# Altium project Keyboard_Mouse.PrjPcb
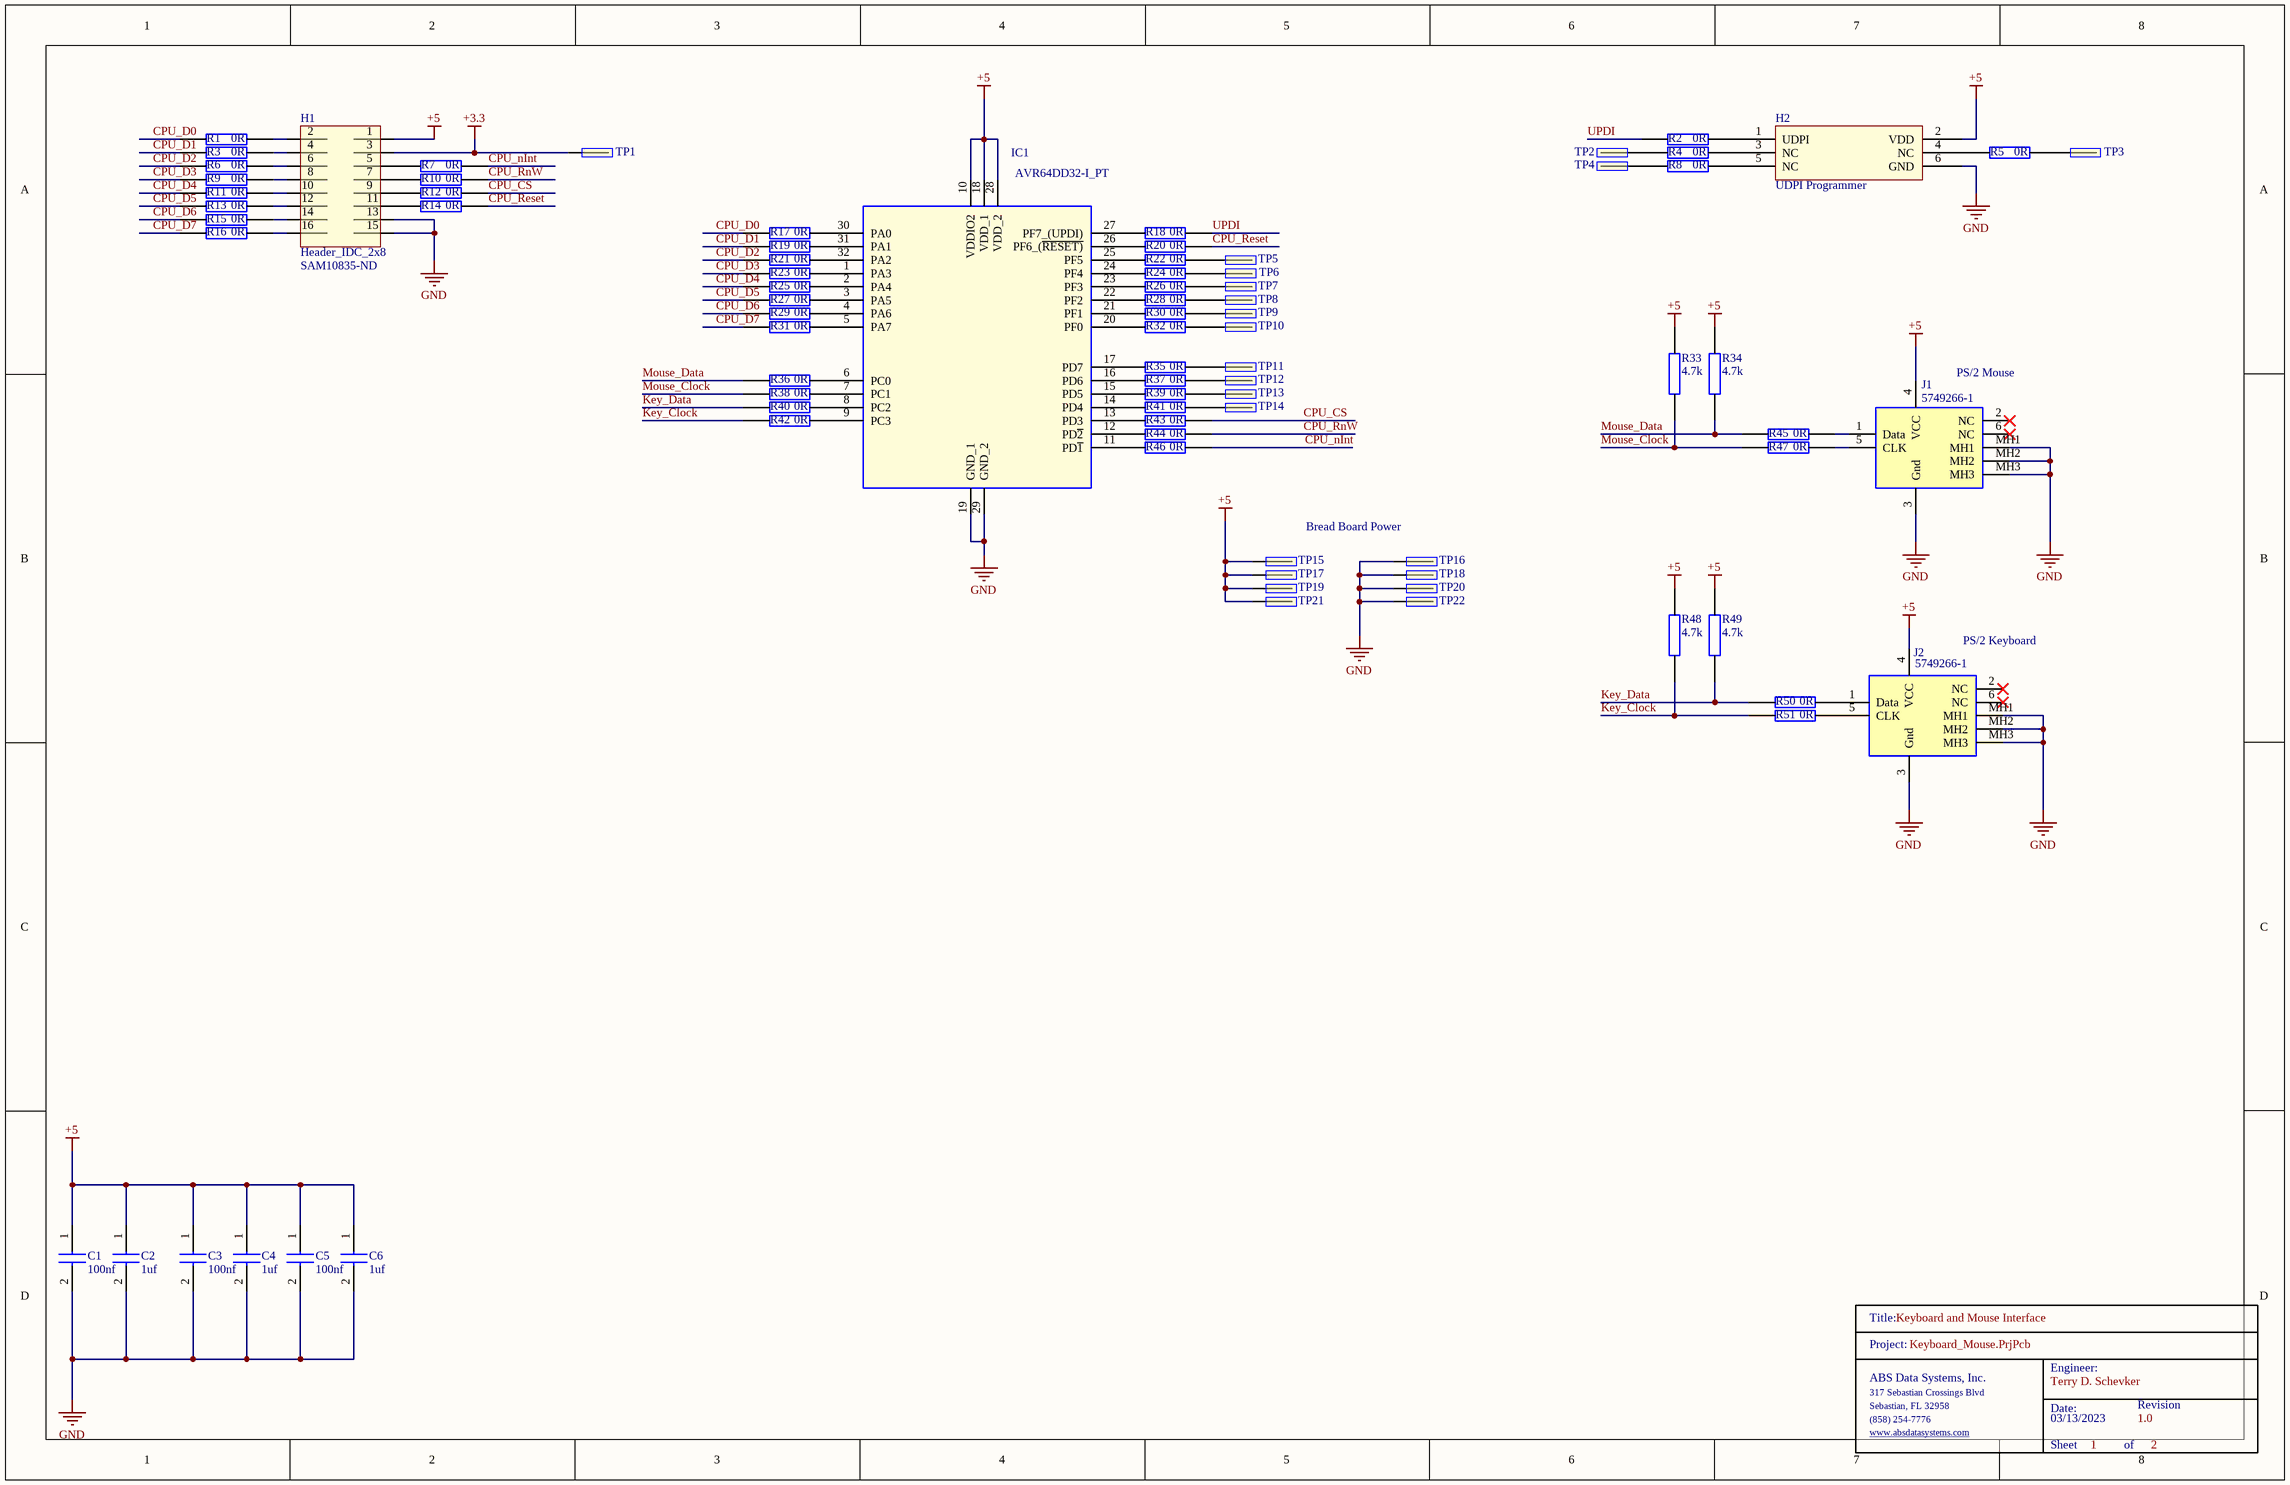
[diagram p0: Keyboard_Mouse_Card.SchDoc]
2 sheets, 134 parts. Net scope: global (net labels, ports and power ports of the same name join across sheets).
Board file: Keyboard_Mouse_PCB.PcbDoc
Sheets:
  Keyboard_Mouse_Card.SchDoc
  Keyboard_Mouse_LED_Monitor.SchDoc

## Sheet Keyboard_Mouse_Card.SchDoc: Keyboard and Mouse Interface
size Tabloid; Date: 03/13/2023; Engineer: Terry D. Schevker; Revision: 1.0; SheetNumber: 1; SheetTotal: 2

### Parts
C1  100nf  [0603]
C2  1uf  [0603]
C3  100nf  [0603]
C4  1uf  [0603]
C5  100nf  [0603]
C6  1uf  [0603]
H1  Header_IDC_2x8  Supplier Part Number 1: SAM10835-ND  [HEADER16]
H2  UDPI Programmer  [HDR2X3]
IC1  AVR64DD32-I_PT  [QFP80P900X900X120-32N]
J1  5749266-1  [57492661]
J2  5749266-1  [57492661]
R1  0R  [0603]
R2  0R  [0603]
R3  0R  [0603]
R4  0R  [0603]
R5  0R  [0603]
R6  0R  [0603]
R7  0R  [0603]
R8  0R  [0603]
R9  0R  [0603]
R10  0R  [0603]
R11  0R  [0603]
R12  0R  [0603]
R13  0R  [0603]
R14  0R  [0603]
R15  0R  [0603]
R16  0R  [0603]
R17  0R  [0603]
R18  0R  [0603]
R19  0R  [0603]
R20  0R  [0603]
R21  0R  [0603]
R22  0R  [0603]
R23  0R  [0603]
R24  0R  [0603]
R25  0R  [0603]
R26  0R  [0603]
R27  0R  [0603]
R28  0R  [0603]
R29  0R  [0603]
R30  0R  [0603]
R31  0R  [0603]
R32  0R  [0603]
R33  4.7k  [0603]
R34  4.7k  [0603]
R35  0R  [0603]
R36  0R  [0603]
R37  0R  [0603]
R38  0R  [0603]
R39  0R  [0603]
R40  0R  [0603]
R41  0R  [0603]
R42  0R  [0603]
R43  0R  [0603]
R44  0R  [0603]
R45  0R  [0603]
R46  0R  [0603]
R47  0R  [0603]
R48  4.7k  [0603]
R49  4.7k  [0603]
R50  0R  [0603]
R51  0R  [0603]
TitleBlock_1  TitleBlock  (value not drawn)  (graphical)
TP1  TP  [TP]  (value not drawn)
TP2  TP  [TP]  (value not drawn)
TP3  TP  [TP]  (value not drawn)
TP4  TP  [TP]  (value not drawn)
TP5  TP  [TP]  (value not drawn)
TP6  TP  [TP]  (value not drawn)
TP7  TP  [TP]  (value not drawn)
TP8  TP  [TP]  (value not drawn)
TP9  TP  [TP]  (value not drawn)
TP10  TP  [TP]  (value not drawn)
TP11  TP  [TP]  (value not drawn)
TP12  TP  [TP]  (value not drawn)
TP13  TP  [TP]  (value not drawn)
TP14  TP  [TP]  (value not drawn)
TP15  TP  [TP]  (value not drawn)
TP16  TP  [TP]  (value not drawn)
TP17  TP  [TP]  (value not drawn)
TP18  TP  [TP]  (value not drawn)
TP19  TP  [TP]  (value not drawn)
TP20  TP  [TP]  (value not drawn)
TP21  TP  [TP]  (value not drawn)
TP22  TP  [TP]  (value not drawn)

### Nets
+3.3: H1.3 TP1.1
+5: C1.1 C2.1 C3.1 C4.1 C5.1 C6.1 H1.1 H2.2(VDD) IC1.10(VDDIO2) IC1.18(VDD_1) IC1.28(VDD_2) J1.4(VCC) J2.4(VCC) R33.1 R34.1 R48.1 R49.1 TP15.1 TP17.1 TP19.1 TP21.1
GND: C1.2 C2.2 C3.2 C4.2 C5.2 C6.2 H1.13 H1.15 H2.6(GND) IC1.19(GND_1) IC1.29(GND_2) J1.3(Gnd) J1.MH1 J1.MH2 J1.MH3 J2.3(Gnd) J2.MH1 J2.MH2 J2.MH3 TP16.1 TP18.1 TP20.1 TP22.1
CPU_CS: R12.2 R43.2
CPU_D0: R1.1 R17.1
CPU_D1: R3.1 R19.1
CPU_D2: R6.1 R21.1
CPU_D3: R9.1 R23.1
CPU_D4: R11.1 R25.1
CPU_D5: R13.1 R27.1
CPU_D6: R15.1 R29.1
CPU_D7: R16.1 R31.1
CPU_nInt: R7.2 R46.2
CPU_Reset: R14.2 R20.2
CPU_RnW: R10.2 R44.2
Key_Clock: R42.1 R48.2 R51.1
Key_Data: R40.1 R49.2 R50.1
Mouse_Clock: R33.2 R38.1 R47.1
Mouse_Data: R34.2 R36.1 R45.1
UPDI: R2.1 R18.2
NetH1_2: H1.2 R1.2
NetH1_4: H1.4 R3.2
NetH1_5: H1.5 R7.1
NetH1_6: H1.6 R6.2
NetH1_7: H1.7 R10.1
NetH1_8: H1.8 R9.2
NetH1_9: H1.9 R12.1
NetH1_10: H1.10 R11.2
NetH1_11: H1.11 R14.1
NetH1_12: H1.12 R13.2
NetH1_14: H1.14 R15.2
NetH1_16: H1.16 R16.2
NetH2_1: H2.1(UDPI) R2.2
NetH2_3: H2.3(NC) R4.2
NetH2_4: H2.4(NC) R5.1
NetH2_5: H2.5(NC) R8.2
NetIC1_1: IC1.1(PA3) R23.2
NetIC1_2: IC1.2(PA4) R25.2
NetIC1_3: IC1.3(PA5) R27.2
NetIC1_4: IC1.4(PA6) R29.2
NetIC1_5: IC1.5(PA7) R31.2
NetIC1_6: IC1.6(PC0) R36.2
NetIC1_7: IC1.7(PC1) R38.2
NetIC1_8: IC1.8(PC2) R40.2
NetIC1_9: IC1.9(PC3) R42.2
NetIC1_11: IC1.11(PD~{1}) R46.1
NetIC1_12: IC1.12(PD~{2}) R44.1
NetIC1_13: IC1.13(PD3) R43.1
NetIC1_14: IC1.14(PD4) R41.1
NetIC1_15: IC1.15(PD5) R39.1
NetIC1_16: IC1.16(PD6) R37.1
NetIC1_17: IC1.17(PD7) R35.1
NetIC1_20: IC1.20(PF0) R32.1
NetIC1_21: IC1.21(PF1) R30.1
NetIC1_22: IC1.22(PF2) R28.1
NetIC1_23: IC1.23(PF3) R26.1
NetIC1_24: IC1.24(PF4) R24.1
NetIC1_25: IC1.25(PF5) R22.1
NetIC1_26: IC1.26(PF6_(~{RESET)}) R20.1
NetIC1_27: IC1.27(PF7_(UPDI)) R18.1
NetIC1_30: IC1.30(PA0) R17.2
NetIC1_31: IC1.31(PA1) R19.2
NetIC1_32: IC1.32(PA2) R21.2
NetJ1_1: J1.1(Data) R45.2
NetJ1_5: J1.5(CLK) R47.2
NetJ2_1: J2.1(Data) R50.2
NetJ2_5: J2.5(CLK) R51.2
NetR4_1: R4.1 TP2.1
NetR5_2: R5.2 TP3.1
NetR8_1: R8.1 TP4.1
NetR22_2: R22.2 TP5.1
NetR24_2: R24.2 TP6.1
NetR26_2: R26.2 TP7.1
NetR28_2: R28.2 TP8.1
NetR30_2: R30.2 TP9.1
NetR32_2: R32.2 TP10.1
NetR35_2: R35.2 TP11.1
NetR37_2: R37.2 TP12.1
NetR39_2: R39.2 TP13.1
NetR41_2: R41.2 TP14.1

Not connected (* = marked no-connect by the designer): J1 2(NC)* 6(NC)*; J2 2(NC)* 6(NC)*

### Notes on the sheet
- (near J1) PS/2 Mouse
- Bread Board Power
- (near J2) PS/2 Keyboard
- (in symbol TitleBlock) Title:; Project:; Engineer:; ABS Data Systems, Inc.; 317 Sebastian Crossings Blvd; Sebastian, FL 32958; Date:; Revision; (858) 254-7776; www.absdatasystems.com; Sheet; of

### Library data of the parts
C1 C3 C5 = CL10B104JB8NNNC: Samsung Electro-Mechanics 0603 100nf
C2 C4 C6 = CL10B105KA8NNNL: Samsung Electro-Mechanics 0603 1uf
H1 = Header_IDC_2x8: 16 Pin 2x8 Through Hold IDC Connector; Manufacturer: Samtec; Manufacturer Part Number: TST-108-01-G-D; Number of Contacts: 16; Gender: Male; Connector Type: Male Pin; Pitch: 2.54mm; Row Spacing: 0.1inch; Supplier 1: Digi-Key; RoHS: Yes; Category: Headers and Wire Housings; Stock 1: 227; Pricing 1: 1=2.85000, 10=2.73600, 100=2.28000, 500=1.93800, 1000=1.65300, 5000=1.48200 (USD); Mount: Through Hole; Contact Plating: Gold; Contact Material: Bronze; Housing Material: Polyester; Housing Color: Black; Color: Black; Min Operating Temperature: -55°C; Max Operating Temperature: 125°C; Number of Rows: 2; Termination: Solder; Packaging: Rail/Tube; Orientation: Straight; Number of Positions: 16; Length: 27.94mm; Depth: 9.27mm; Contact Mating Length: 0.25inch; REACH SVHC: No SVHC; ComponentLink1URL: https://datasheet.ciiva.com/739/tst-mkt-739845.pdf?src-supplier=Digi-Key; ComponentLink1Description: https://datasheet.ciiva.com/739/tst-mkt-739845.pdf?src-supplier=Digi-Key; ComponentLink2URL: https://datasheet.ciiva.com/10018/htst-10018510.pdf?src-supplier=Avnet; ComponentLink2Description: https://datasheet.ciiva.com/10018/htst-10018510.pdf?src-supplier=Avnet
H2 = UDPI Programmer: 6 Pin 2X3 Through Hole Header
IC1 = AVR64DD32-I_PT: Integrated Circuit; Manufacturer_Name: Microchip; Manufacturer_Part_Number: AVR64DD32-I/PT | MULTI-VOLTAGE I/O; Datasheet Link: https://www.microchip.com/en-us/product/AVR64DD32; Height: 1.2mm
J1 J2 = 5749266-1: Circular DIN Connectors 6 P R/A W/O HOLDDOWN; Manufacturer_Name: TE Connectivity; Geometry.Height: 13mm; Mouser Part Number: 571-5749266-1; Mouser Price/Stock: https://www.mouser.co.uk/ProductDetail/TE-Connectivity/5749266-1?qs=XlZqES4cpWaWvZ%2F3L%252BlRxA%3D%3D; Manufacturer_Part_Number: 5749266-1; Datasheet Link: https://componentsearchengine.com/Datasheets/1/5749266-1.pdf
R1-R32 R35-R47 R50 R51 = RC0603JR-070RL: YAGEO 0603 0 ohm; Manufacturer_Name: KEMET; Geometry.Height: 0.55mm; Mouser Part Number: 603-RC0603JR-070RL; Mouser Price/Stock: https://www.mouser.co.uk/ProductDetail/YAGEO/RC0603JR-070RL?qs=2cAdsCoAWRGWyPcuXgGiXQ%3D%3D; Manufacturer_Part_Number: RC0603JR-070RL; Datasheet Link: https://datasheet.datasheetarchive.com/originals/distributors/Datasheets_SAMA/902f9e387b938f871d31120f5fc1d65e.pdf
R33 R34 R48 R49 = RC0603FR-104K7L: YAGEO 0603 4.7k; Manufacturer_Name: KEMET; Manufacturer_Part_Number: RC0603JR-070RL; Geometry.Height: 0.55mm; Mouser Part Number: 603-RC0603JR-070RL; Mouser Price/Stock: https://www.mouser.co.uk/ProductDetail/YAGEO/RC0603JR-070RL?qs=2cAdsCoAWRGWyPcuXgGiXQ%3D%3D; Datasheet Link: https://datasheet.datasheetarchive.com/originals/distributors/Datasheets_SAMA/902f9e387b938f871d31120f5fc1d65e.pdf
TP1-TP22 = TP: Manufacturer: Samtec; Manufacturer Part Number: TST-105-01-G-D; Number of Contacts: 16; Gender: Male; Connector Type: Male Pin; Pitch: 2.54mm; Row Spacing: 0.1inch; Supplier 1: Digi-Key; RoHS: Yes; Category: Headers and Wire Housings; Stock 1: 227; Pricing 1: 1=2.85000, 10=2.73600, 100=2.28000, 500=1.93800, 1000=1.65300, 5000=1.48200 (USD); Mount: Through Hole; Contact Plating: Gold; Contact Material: Bronze; Housing Material: Polyester; Housing Color: Black; Color: Black; Min Operating Temperature: -55°C; Max Operating Temperature: 125°C; Number of Rows: 2; Termination: Solder; Packaging: Rail/Tube; Orientation: Straight; Number of Positions: 16; Length: 27.94mm; Depth: 9.27mm; Contact Mating Length: 0.25inch; REACH SVHC: No SVHC; ComponentLink1URL: https://datasheet.ciiva.com/739/tst-mkt-739845.pdf?src-supplier=Digi-Key; ComponentLink1Description: https://datasheet.ciiva.com/739/tst-mkt-739845.pdf?src-supplier=Digi-Key; ComponentLink2URL: https://datasheet.ciiva.com/10018/htst-10018510.pdf?src-supplier=Avnet; ComponentLink2Description: https://datasheet.ciiva.com/10018/htst-10018510.pdf?src-supplier=Avnet

## Sheet Keyboard_Mouse_LED_Monitor.SchDoc: Keyboard and Mouse LED Monitor
size Tabloid; Date: 05/10/2023; Engineer: Terry D. Schevker; Revision: 1.0; SheetNumber: 2; SheetTotal: 2
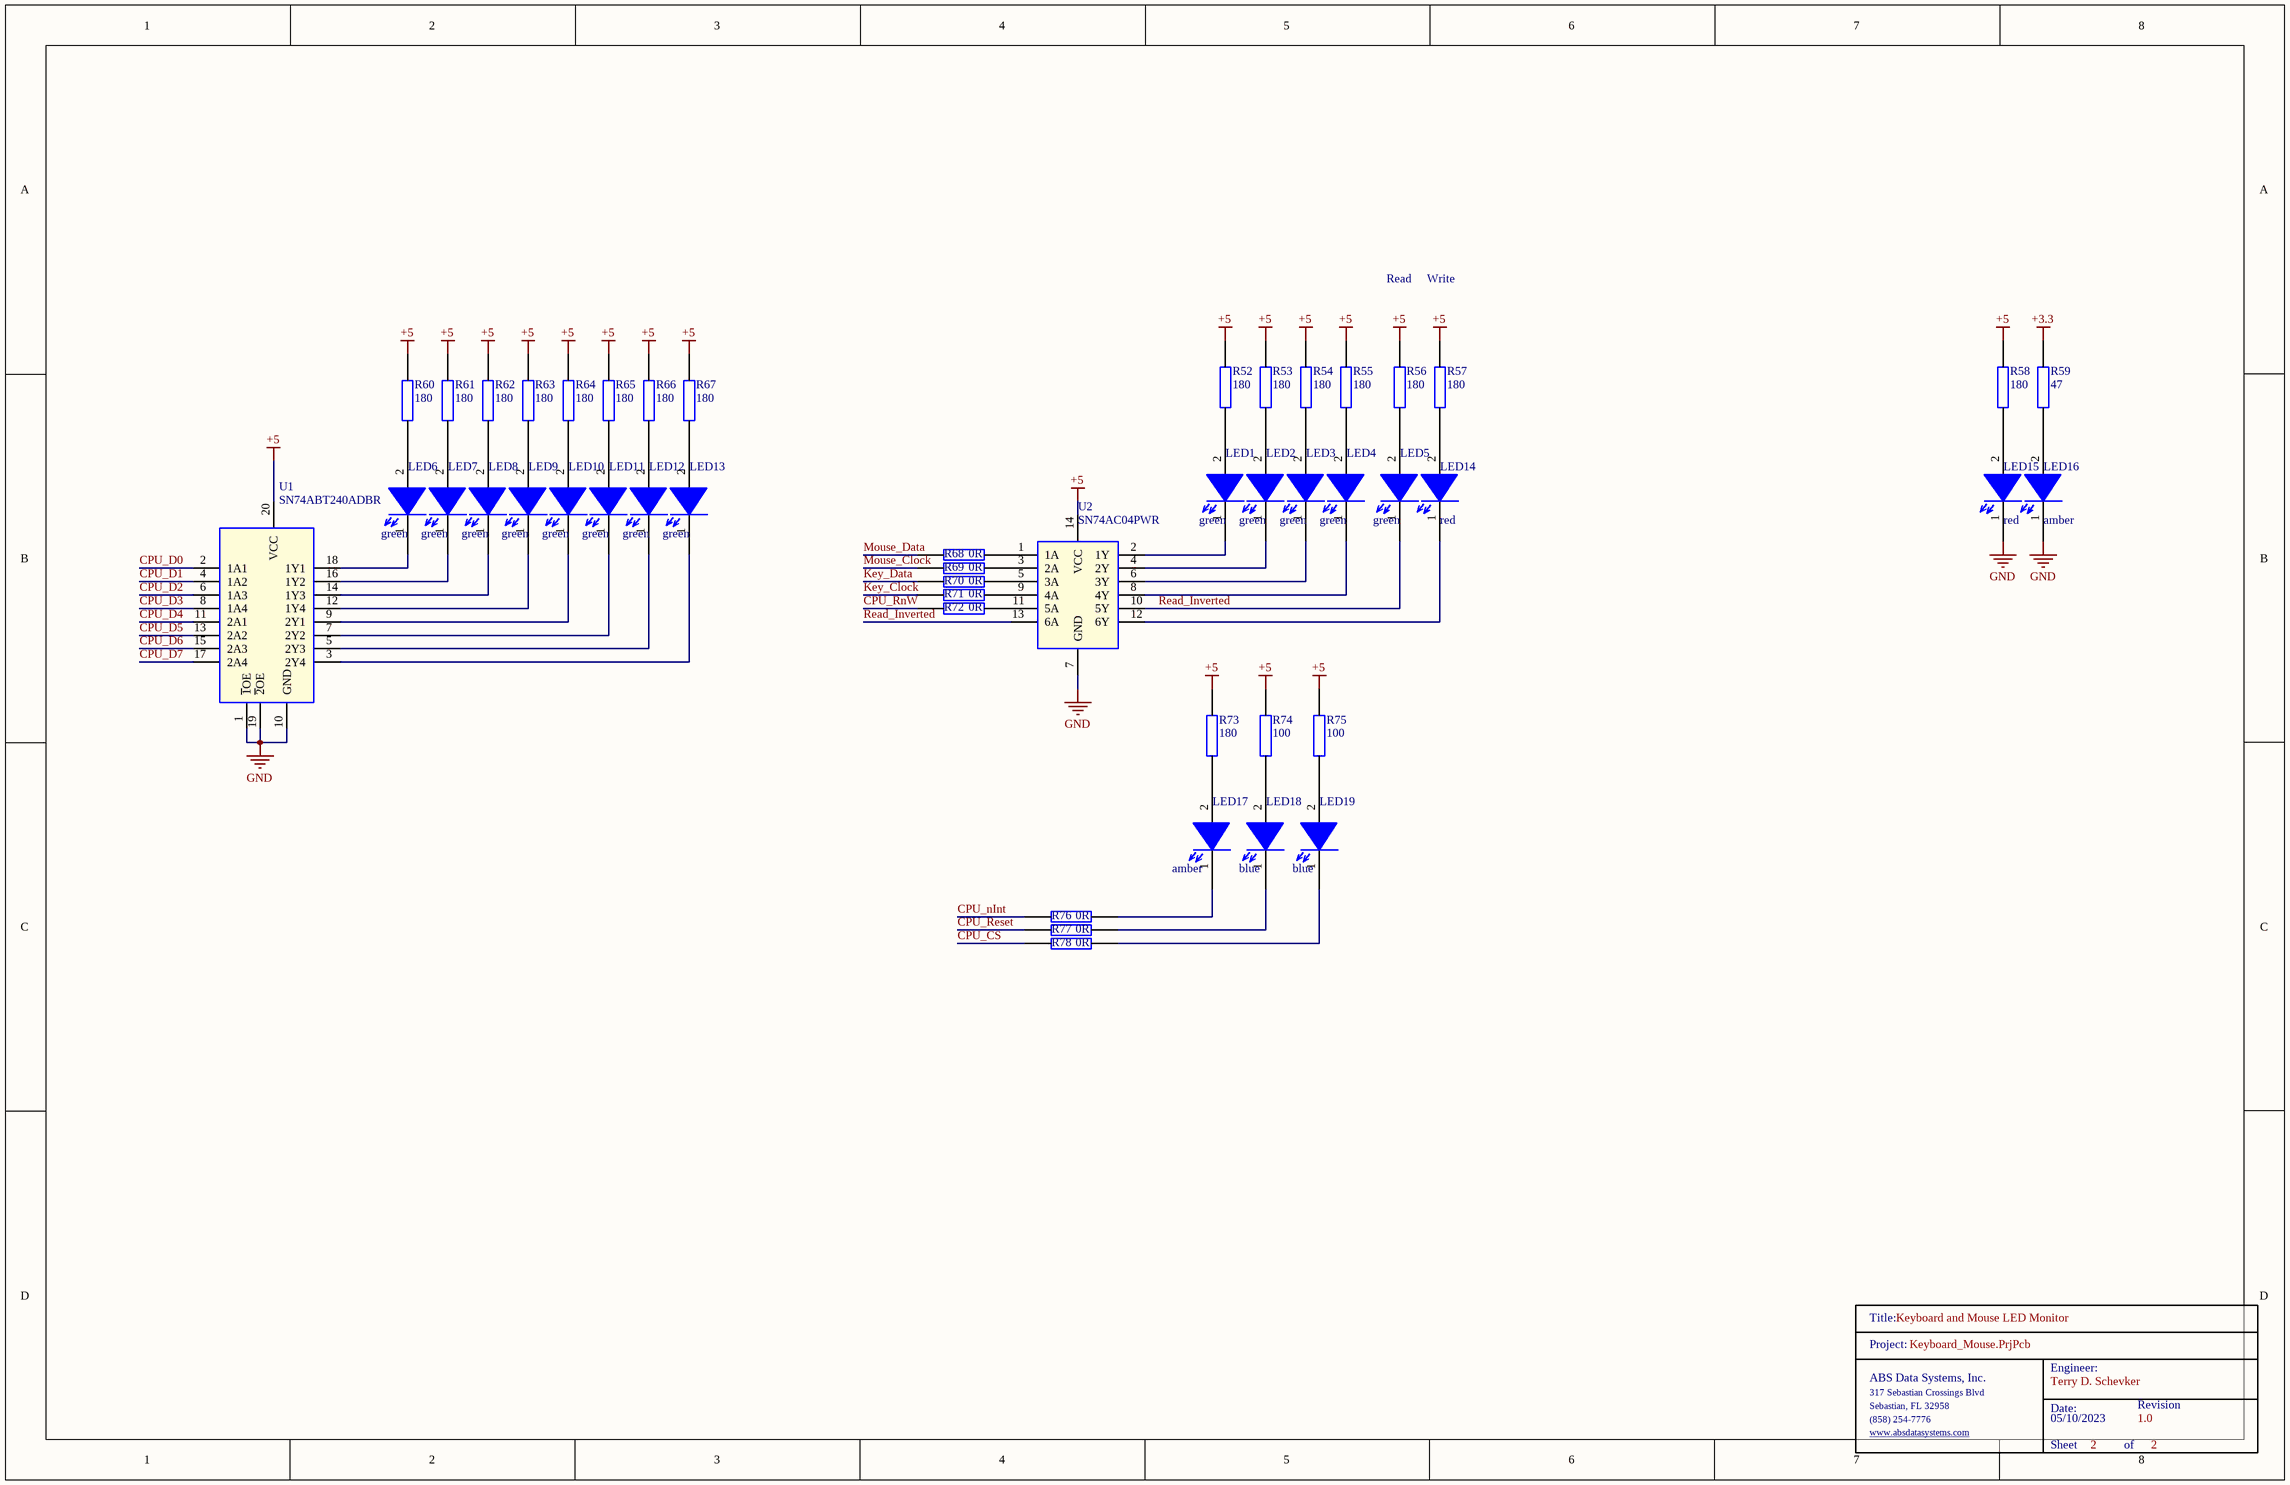
[diagram p1: Keyboard_Mouse_LED_Monitor.SchDoc]

### Parts
LED1  green  [0603_Diode]
LED2  green  [0603_Diode]
LED3  green  [0603_Diode]
LED4  green  [0603_Diode]
LED5  green  [0603_Diode]
LED6  green  [0603_Diode]
LED7  green  [0603_Diode]
LED8  green  [0603_Diode]
LED9  green  [0603_Diode]
LED10  green  [0603_Diode]
LED11  green  [0603_Diode]
LED12  green  [0603_Diode]
LED13  green  [0603_Diode]
LED14  red  [0603_Diode]
LED15  red  [0603_Diode]
LED16  amber  [0603_Diode]
LED17  amber  [0603_Diode]
LED18  blue  [0603_Diode]
LED19  blue  [0603_Diode]
R52  180  [0603]
R53  180  [0603]
R54  180  [0603]
R55  180  [0603]
R56  180  [0603]
R57  180  [0603]
R58  180  [0603]
R59  47  [0603]
R60  180  [0603]
R61  180  [0603]
R62  180  [0603]
R63  180  [0603]
R64  180  [0603]
R65  180  [0603]
R66  180  [0603]
R67  180  [0603]
R68  0R  [0603]
R69  0R  [0603]
R70  0R  [0603]
R71  0R  [0603]
R72  0R  [0603]
R73  180  [0603]
R74  100  [0603]
R75  100  [0603]
R76  0R  [0603]
R77  0R  [0603]
R78  0R  [0603]
TitleBlock_2  TitleBlock  (value not drawn)  (graphical)
U1  SN74ABT240ADBR  [SOP65P780X200-20N]
U2  SN74AC04PWR  [SOP65P640X120-14N]

### Nets
+3.3: R59.1
+5: R52.2 R53.2 R54.2 R55.2 R56.2 R57.2 R58.2 R60.2 R61.2 R62.2 R63.2 R64.2 R65.2 R66.2 R67.2 R73.2 R74.1 R75.1 U1.20(VCC) U2.14(VCC)
GND: LED15.1(K) LED16.1(K) U1.1(~{1}OE) U1.10(GND) U1.19(~{2}OE) U2.7(GND)
CPU_CS: R78.1
CPU_D0: U1.2(1A1)
CPU_D1: U1.4(1A2)
CPU_D2: U1.6(1A3)
CPU_D3: U1.8(1A4)
CPU_D4: U1.11(2A1)
CPU_D5: U1.13(2A2)
CPU_D6: U1.15(2A3)
CPU_D7: U1.17(2A4)
CPU_nInt: R76.1
CPU_Reset: R77.1
CPU_RnW: R72.1
Key_Clock: R71.1
Key_Data: R70.1
Mouse_Clock: R69.1
Mouse_Data: R68.1
Read_Inverted: LED5.1(K) U2.10(5Y) U2.13(6A)
NetLED1_1: LED1.1(K) U2.2(1Y)
NetLED1_2: LED1.2(A) R52.1
NetLED2_1: LED2.1(K) U2.4(2Y)
NetLED2_2: LED2.2(A) R53.1
NetLED3_1: LED3.1(K) U2.6(3Y)
NetLED3_2: LED3.2(A) R54.1
NetLED4_1: LED4.1(K) U2.8(4Y)
NetLED4_2: LED4.2(A) R55.1
NetLED5_2: LED5.2(A) R56.1
NetLED6_1: LED6.1(K) U1.18(1Y1)
NetLED6_2: LED6.2(A) R60.1
NetLED7_1: LED7.1(K) U1.16(1Y2)
NetLED7_2: LED7.2(A) R61.1
NetLED8_1: LED8.1(K) U1.14(1Y3)
NetLED8_2: LED8.2(A) R62.1
NetLED9_1: LED9.1(K) U1.12(1Y4)
NetLED9_2: LED9.2(A) R63.1
NetLED10_1: LED10.1(K) U1.9(2Y1)
NetLED10_2: LED10.2(A) R64.1
NetLED11_1: LED11.1(K) U1.7(2Y2)
NetLED11_2: LED11.2(A) R65.1
NetLED12_1: LED12.1(K) U1.5(2Y3)
NetLED12_2: LED12.2(A) R66.1
NetLED13_1: LED13.1(K) U1.3(2Y4)
NetLED13_2: LED13.2(A) R67.1
NetLED14_1: LED14.1(K) U2.12(6Y)
NetLED14_2: LED14.2(A) R57.1
NetLED15_2: LED15.2(A) R58.1
NetLED16_2: LED16.2(A) R59.2
NetLED17_1: LED17.1(K) R76.2
NetLED17_2: LED17.2(A) R73.1
NetLED18_1: LED18.1(K) R77.2
NetLED18_2: LED18.2(A) R74.2
NetLED19_1: LED19.1(K) R78.2
NetLED19_2: LED19.2(A) R75.2
NetR68_2: R68.2 U2.1(1A)
NetR69_2: R69.2 U2.3(2A)
NetR70_2: R70.2 U2.5(3A)
NetR71_2: R71.2 U2.9(4A)
NetR72_2: R72.2 U2.11(5A)

### Notes on the sheet
- Read
- Write
- (in symbol TitleBlock) Title:; Project:; Engineer:; ABS Data Systems, Inc.; 317 Sebastian Crossings Blvd; Sebastian, FL 32958; Date:; Revision; (858) 254-7776; www.absdatasystems.com; Sheet; of

### Library data of the parts
LED1-LED13 = 150060GS75000: Wurth Elektronik 0603 green; Manufacturer: Wurth Electronics; Wavelength: 520nm; Viewing Angle: 140°; Lens Style: Clear,Rectangular; Luminous Intensity: 430mcd; Forward Current: 30mA; Forward Voltage: 3.2V; Test Current: 20mA; Supplier 1: Digi-Key; Manufacturer Part Number: 150060GS75000; RoHS: Yes; Category: LEDs; Stock 1: 71509; Pricing 1: 1=0.14000, 50=0.13300, 100=0.11400, 500=0.09900 (USD); Mount: Surface Mount; Case/Package: 0603; Color: Green; Case Code (Metric): 1608; Case Code (Imperial): 0603; Min Operating Temperature: -40°C; Max Operating Temperature: 85°C; Package Quantity: 4000; Packaging: Tape and Reel; Dominant Wavelength: 520nm; Length: 1.6mm; Width: 0.8mm; Height: 0.7mm; REACH SVHC: Unknown; Lead Free: Lead Free; ComponentLink1URL: https://datasheet.ciiva.com/29562/150060gs75000-29562868.pdf?src-supplier=Digi-Key; ComponentLink1Description: https://datasheet.ciiva.com/29562/150060gs75000-29562868.pdf?src-supplier=Digi-Key; ComponentLink2URL: https://datasheet.ciiva.com/29279/759427-da-01-en-chipled-0603-w-kl-gruen-150060gs75000-29279201.pdf?src-supplier=Conrad; ComponentLink2Description: https://datasheet.ciiva.com/29279/759427-da-01-en-chipled-0603-w-kl-gruen-150060gs75000-29279201.pdf?src-supplier=Conrad; ComponentLink3URL: https://datasheet.ciiva.com/29562/150060gs75000-29562869.pdf?src-supplier=Digi-Key; ComponentLink3Description: https://datasheet.ciiva.com/29562/150060gs75000-29562869.pdf?src-supplier=Digi-Key; ComponentLink4URL: https://datasheet.ciiva.com/29562/150060gs75000-29562870.pdf?src-supplier=Digi-Key; ComponentLink4Description: https://datasheet.ciiva.com/29562/150060gs75000-29562870.pdf?src-supplier=Digi-Key
LED14 LED15 = 150060RS75000: Wurth Elektronik 0603 red; Manufacturer: Wurth Electronics; Manufacturer Part Number: 150060GS75000; Color: Green; Wavelength: 520nm; Viewing Angle: 140°; Lens Style: Clear,Rectangular; Luminous Intensity: 430mcd; Forward Current: 30mA; Forward Voltage: 3.2V; Test Current: 20mA; Supplier 1: Digi-Key; RoHS: Yes; Category: LEDs; Stock 1: 71509; Pricing 1: 1=0.14000, 50=0.13300, 100=0.11400, 500=0.09900 (USD); Mount: Surface Mount; Case/Package: 0603; Case Code (Metric): 1608; Case Code (Imperial): 0603; Min Operating Temperature: -40°C; Max Operating Temperature: 85°C; Package Quantity: 4000; Packaging: Tape and Reel; Dominant Wavelength: 520nm; Length: 1.6mm; Width: 0.8mm; Height: 0.7mm; REACH SVHC: Unknown; Lead Free: Lead Free; ComponentLink1URL: https://datasheet.ciiva.com/29562/150060gs75000-29562868.pdf?src-supplier=Digi-Key; ComponentLink1Description: https://datasheet.ciiva.com/29562/150060gs75000-29562868.pdf?src-supplier=Digi-Key; ComponentLink2URL: https://datasheet.ciiva.com/29279/759427-da-01-en-chipled-0603-w-kl-gruen-150060gs75000-29279201.pdf?src-supplier=Conrad; ComponentLink2Description: https://datasheet.ciiva.com/29279/759427-da-01-en-chipled-0603-w-kl-gruen-150060gs75000-29279201.pdf?src-supplier=Conrad; ComponentLink3URL: https://datasheet.ciiva.com/29562/150060gs75000-29562869.pdf?src-supplier=Digi-Key; ComponentLink3Description: https://datasheet.ciiva.com/29562/150060gs75000-29562869.pdf?src-supplier=Digi-Key; ComponentLink4URL: https://datasheet.ciiva.com/29562/150060gs75000-29562870.pdf?src-supplier=Digi-Key; ComponentLink4Description: https://datasheet.ciiva.com/29562/150060gs75000-29562870.pdf?src-supplier=Digi-Key
LED16 LED17 = 150060AS75000: Wurth Elektronik 0603 amber; Manufacturer: Wurth Electronics; Manufacturer Part Number: 150060GS75000; Color: Green; Wavelength: 520nm; Viewing Angle: 140°; Lens Style: Clear,Rectangular; Luminous Intensity: 430mcd; Forward Current: 30mA; Forward Voltage: 3.2V; Test Current: 20mA; Supplier 1: Digi-Key; RoHS: Yes; Category: LEDs; Stock 1: 71509; Pricing 1: 1=0.14000, 50=0.13300, 100=0.11400, 500=0.09900 (USD); Mount: Surface Mount; Case/Package: 0603; Case Code (Metric): 1608; Case Code (Imperial): 0603; Min Operating Temperature: -40°C; Max Operating Temperature: 85°C; Package Quantity: 4000; Packaging: Tape and Reel; Dominant Wavelength: 520nm; Length: 1.6mm; Width: 0.8mm; Height: 0.7mm; REACH SVHC: Unknown; Lead Free: Lead Free; ComponentLink1URL: https://datasheet.ciiva.com/29562/150060gs75000-29562868.pdf?src-supplier=Digi-Key; ComponentLink1Description: https://datasheet.ciiva.com/29562/150060gs75000-29562868.pdf?src-supplier=Digi-Key; ComponentLink2URL: https://datasheet.ciiva.com/29279/759427-da-01-en-chipled-0603-w-kl-gruen-150060gs75000-29279201.pdf?src-supplier=Conrad; ComponentLink2Description: https://datasheet.ciiva.com/29279/759427-da-01-en-chipled-0603-w-kl-gruen-150060gs75000-29279201.pdf?src-supplier=Conrad; ComponentLink3URL: https://datasheet.ciiva.com/29562/150060gs75000-29562869.pdf?src-supplier=Digi-Key; ComponentLink3Description: https://datasheet.ciiva.com/29562/150060gs75000-29562869.pdf?src-supplier=Digi-Key; ComponentLink4URL: https://datasheet.ciiva.com/29562/150060gs75000-29562870.pdf?src-supplier=Digi-Key; ComponentLink4Description: https://datasheet.ciiva.com/29562/150060gs75000-29562870.pdf?src-supplier=Digi-Key
LED18 LED19 = 150060BS75000: Wurth Elektronik 0603 blue; Manufacturer: Wurth Electronics; Manufacturer Part Number: 150060GS75000; Color: Green; Wavelength: 520nm; Viewing Angle: 140°; Lens Style: Clear,Rectangular; Luminous Intensity: 430mcd; Forward Current: 30mA; Forward Voltage: 3.2V; Test Current: 20mA; Supplier 1: Digi-Key; RoHS: Yes; Category: LEDs; Stock 1: 71509; Pricing 1: 1=0.14000, 50=0.13300, 100=0.11400, 500=0.09900 (USD); Mount: Surface Mount; Case/Package: 0603; Case Code (Metric): 1608; Case Code (Imperial): 0603; Min Operating Temperature: -40°C; Max Operating Temperature: 85°C; Package Quantity: 4000; Packaging: Tape and Reel; Dominant Wavelength: 520nm; Length: 1.6mm; Width: 0.8mm; Height: 0.7mm; REACH SVHC: Unknown; Lead Free: Lead Free; ComponentLink1URL: https://datasheet.ciiva.com/29562/150060gs75000-29562868.pdf?src-supplier=Digi-Key; ComponentLink1Description: https://datasheet.ciiva.com/29562/150060gs75000-29562868.pdf?src-supplier=Digi-Key; ComponentLink2URL: https://datasheet.ciiva.com/29279/759427-da-01-en-chipled-0603-w-kl-gruen-150060gs75000-29279201.pdf?src-supplier=Conrad; ComponentLink2Description: https://datasheet.ciiva.com/29279/759427-da-01-en-chipled-0603-w-kl-gruen-150060gs75000-29279201.pdf?src-supplier=Conrad; ComponentLink3URL: https://datasheet.ciiva.com/29562/150060gs75000-29562869.pdf?src-supplier=Digi-Key; ComponentLink3Description: https://datasheet.ciiva.com/29562/150060gs75000-29562869.pdf?src-supplier=Digi-Key; ComponentLink4URL: https://datasheet.ciiva.com/29562/150060gs75000-29562870.pdf?src-supplier=Digi-Key; ComponentLink4Description: https://datasheet.ciiva.com/29562/150060gs75000-29562870.pdf?src-supplier=Digi-Key
R52-R58 R60-R67 R73 = RC0603FR-13180RL: YAGEO 0603 180 ohm; Manufacturer_Name: KEMET; Manufacturer_Part_Number: RC0603JR-070RL; Geometry.Height: 0.55mm; Mouser Part Number: 603-RC0603JR-070RL; Mouser Price/Stock: https://www.mouser.co.uk/ProductDetail/YAGEO/RC0603JR-070RL?qs=2cAdsCoAWRGWyPcuXgGiXQ%3D%3D; Datasheet Link: https://datasheet.datasheetarchive.com/originals/distributors/Datasheets_SAMA/902f9e387b938f871d31120f5fc1d65e.pdf
R59 = RC0603FR-0747KL: YAGEO 0603 47; Manufacturer_Name: KEMET; Manufacturer_Part_Number: RC0603JR-070RL; Geometry.Height: 0.55mm; Mouser Part Number: 603-RC0603JR-070RL; Mouser Price/Stock: https://www.mouser.co.uk/ProductDetail/YAGEO/RC0603JR-070RL?qs=2cAdsCoAWRGWyPcuXgGiXQ%3D%3D; Datasheet Link: https://datasheet.datasheetarchive.com/originals/distributors/Datasheets_SAMA/902f9e387b938f871d31120f5fc1d65e.pdf
R68-R72 R76-R78 = RC0603JR-070RL: as R1 on sheet Keyboard_Mouse_Card; Mouser Part Number: 603-RC0603JR-070RL; Mouser Price/Stock: https://www.mouser.co.uk/ProductDetail/YAGEO/RC0603JR-070RL?qs=2cAdsCoAWRGWyPcuXgGiXQ%3D%3D; Manufacturer_Part_Number: RC0603JR-070RL; Datasheet Link: https://datasheet.datasheetarchive.com/originals/distributors/Datasheets_SAMA/902f9e387b938f871d31120f5fc1d65e.pdf
R74 R75 = RC0603FR-10100RL: YAGEO 0603 100 ohm; Manufacturer_Name: KEMET; Manufacturer_Part_Number: RC0603JR-070RL; Geometry.Height: 0.55mm; Mouser Part Number: 603-RC0603JR-070RL; Mouser Price/Stock: https://www.mouser.co.uk/ProductDetail/YAGEO/RC0603JR-070RL?qs=2cAdsCoAWRGWyPcuXgGiXQ%3D%3D; Datasheet Link: https://datasheet.datasheetarchive.com/originals/distributors/Datasheets_SAMA/902f9e387b938f871d31120f5fc1d65e.pdf
U1 = SN74ABT240ADBR: Octal Buffers/Drivers With 3-State Outputs; Manufacturer_Name: Texas Instruments; Geometry.Height: 2mm; Mouser Part Number: 595-SN74ABT240ADBR; Mouser Price/Stock: https://www.mouser.co.uk/ProductDetail/Texas-Instruments/SN74ABT240ADBR?qs=JHHQeKcAU3Dt82k%252BVyiYdw%3D%3D; Manufacturer_Part_Number: SN74ABT240ADBR; Datasheet Link: http://www.ti.com/lit/gpn/sn74abt240a
U2 = SN74AC04PWR: Hex Inverters; Manufacturer_Name: Texas Instruments; Geometry.Height: 1.2mm; Mouser Part Number: 595-SN74AC04PWR; Mouser Price/Stock: https://www.mouser.co.uk/ProductDetail/Texas-Instruments/SN74AC04PWR?qs=RZS%252BpEsUn7pRvPNqsga4SA%3D%3D; Manufacturer_Part_Number: SN74AC04PWR; Datasheet Link: http://www.ti.com/lit/gpn/sn74ac04

## Nets that join several sheets
+3.3: Keyboard_Mouse_Card (H1.3 TP1.1), Keyboard_Mouse_LED_Monitor (R59.1)
+5: Keyboard_Mouse_Card (21 pins), Keyboard_Mouse_LED_Monitor (20 pins)
GND: Keyboard_Mouse_Card (23 pins), Keyboard_Mouse_LED_Monitor (6 pins)
CPU_CS: Keyboard_Mouse_Card (R12.2 R43.2), Keyboard_Mouse_LED_Monitor (R78.1)
CPU_D0: Keyboard_Mouse_Card (R1.1 R17.1), Keyboard_Mouse_LED_Monitor (U1.2)
CPU_D1: Keyboard_Mouse_Card (R3.1 R19.1), Keyboard_Mouse_LED_Monitor (U1.4)
CPU_D2: Keyboard_Mouse_Card (R6.1 R21.1), Keyboard_Mouse_LED_Monitor (U1.6)
CPU_D3: Keyboard_Mouse_Card (R9.1 R23.1), Keyboard_Mouse_LED_Monitor (U1.8)
CPU_D4: Keyboard_Mouse_Card (R11.1 R25.1), Keyboard_Mouse_LED_Monitor (U1.11)
CPU_D5: Keyboard_Mouse_Card (R13.1 R27.1), Keyboard_Mouse_LED_Monitor (U1.13)
CPU_D6: Keyboard_Mouse_Card (R15.1 R29.1), Keyboard_Mouse_LED_Monitor (U1.15)
CPU_D7: Keyboard_Mouse_Card (R16.1 R31.1), Keyboard_Mouse_LED_Monitor (U1.17)
CPU_nInt: Keyboard_Mouse_Card (R7.2 R46.2), Keyboard_Mouse_LED_Monitor (R76.1)
CPU_Reset: Keyboard_Mouse_Card (R14.2 R20.2), Keyboard_Mouse_LED_Monitor (R77.1)
CPU_RnW: Keyboard_Mouse_Card (R10.2 R44.2), Keyboard_Mouse_LED_Monitor (R72.1)
Key_Clock: Keyboard_Mouse_Card (R42.1 R48.2 R51.1), Keyboard_Mouse_LED_Monitor (R71.1)
Key_Data: Keyboard_Mouse_Card (R40.1 R49.2 R50.1), Keyboard_Mouse_LED_Monitor (R70.1)
Mouse_Clock: Keyboard_Mouse_Card (R33.2 R38.1 R47.1), Keyboard_Mouse_LED_Monitor (R69.1)
Mouse_Data: Keyboard_Mouse_Card (R34.2 R36.1 R45.1), Keyboard_Mouse_LED_Monitor (R68.1)